# EAGLE schematic SenseBox-Eye_v1.2 (EAGLE 9.6.2)
Assembly variants: komplett, ohne fuel-gauge

## Sheet 1 of 5
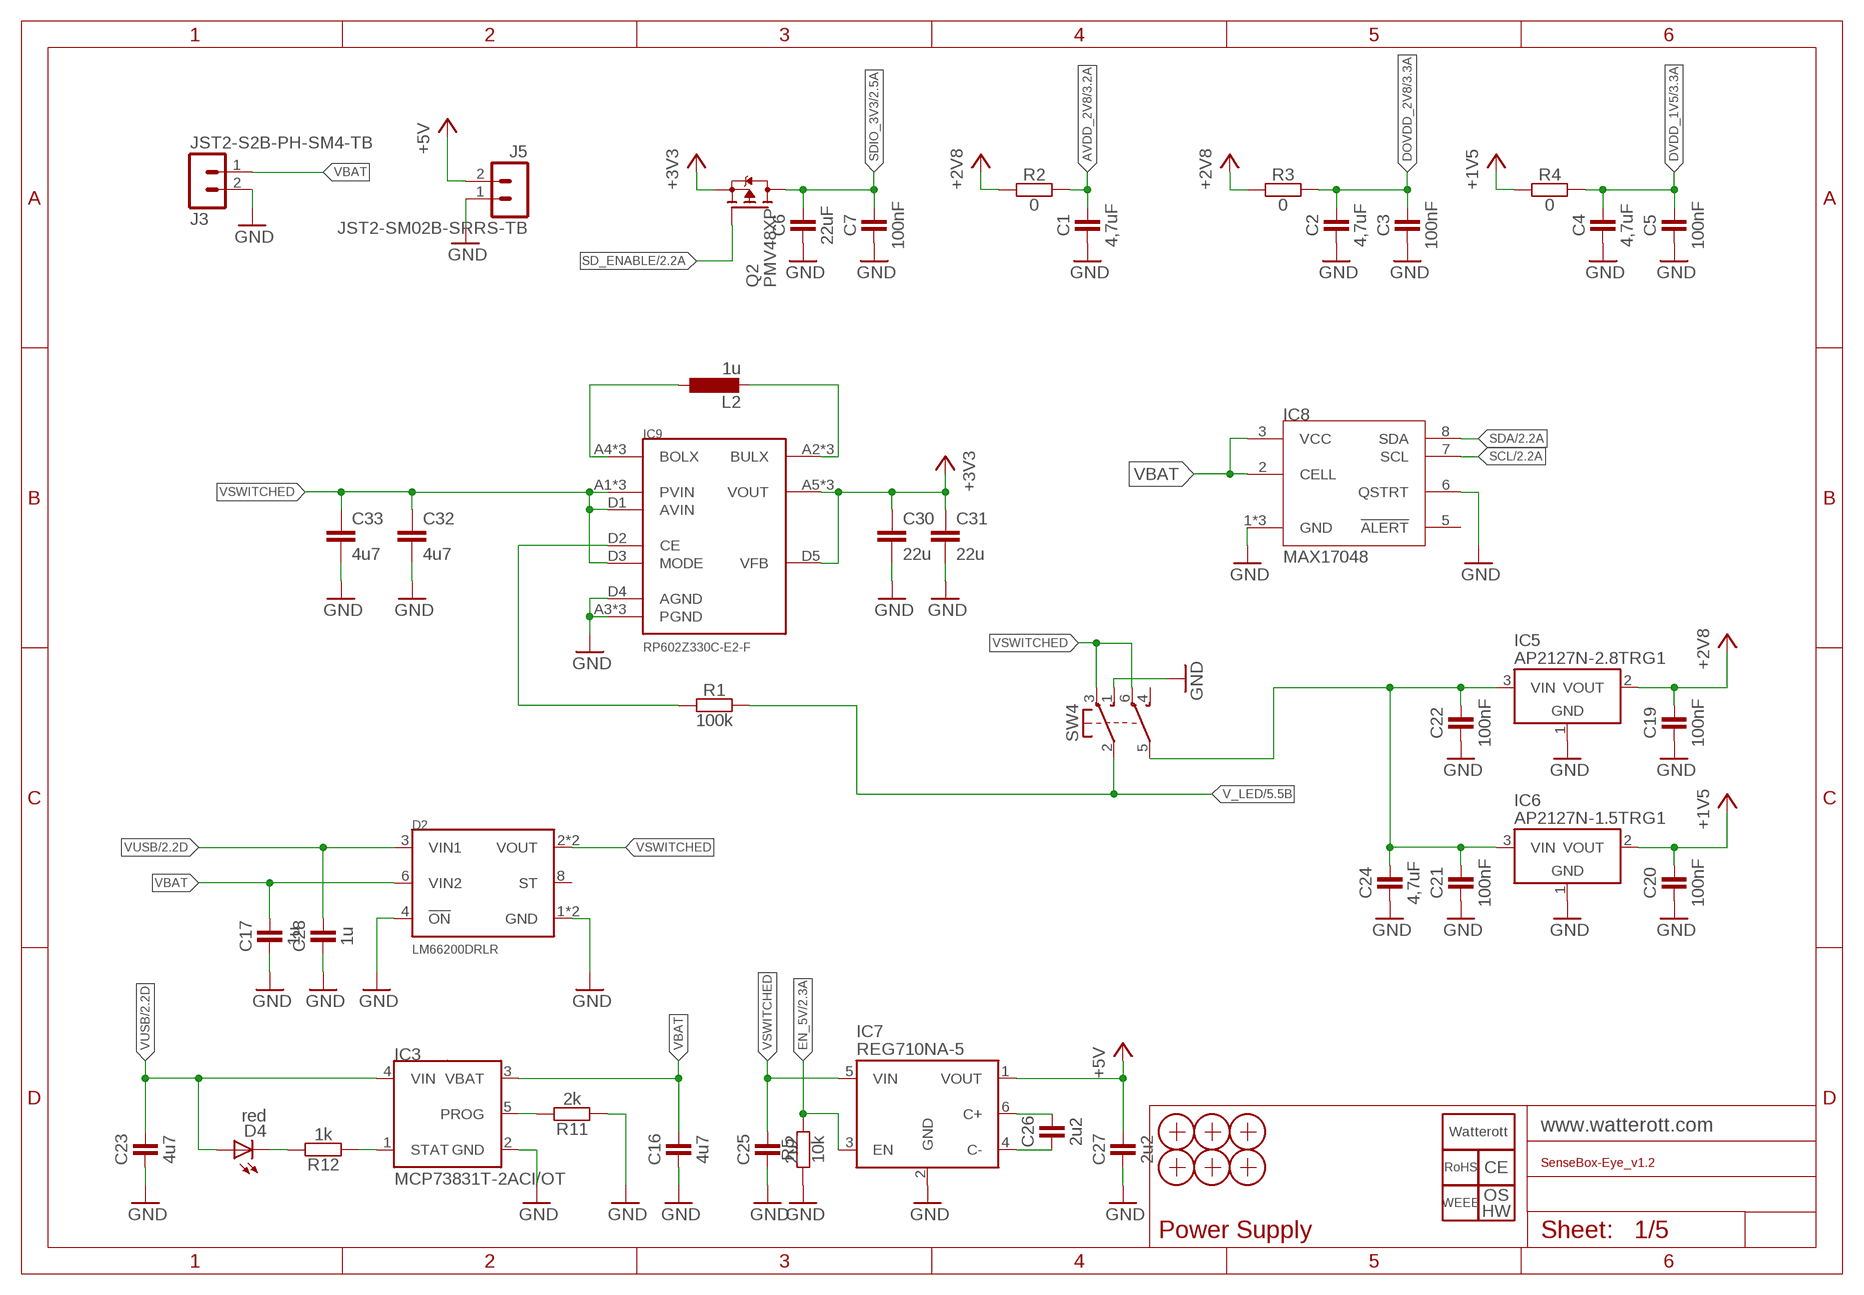
[diagram p0: schematic, sheet 1]

### Parts
C1  4,7uF  CAPACITOR-0402  [C0402]
C2  4,7uF  CAPACITOR-0402  [C0402]
C3  100nF  CAPACITOR-0402  [C0402]
C4  4,7uF  CAPACITOR-0402  [C0402]
C5  100nF  CAPACITOR-0402  [C0402]
C6  22uF  CAPACITOR-0402  [C0402]
C7  100nF  CAPACITOR-0402  [C0402]
C16  4u7  CAPACITOR-0402  [C0402]
C17  1u  CAPACITOR-0402  [C0402]
C19  100nF  CAPACITOR-0402  [C0402]
C20  100nF  CAPACITOR-0402  [C0402]
C21  100nF  CAPACITOR-0402  [C0402]
C22  100nF  CAPACITOR-0402  [C0402]
C23  4u7  CAPACITOR-0402  [C0402]
C24  4,7uF  CAPACITOR-0402  [C0402]
C25  2u2  CAPACITOR-0402  [C0402]
C26  2u2  CAPACITOR-0402  [C0402]
C27  2u2  CAPACITOR-0402  [C0402]
C28  1u  CAPACITOR-0402  [C0402]
C30  22u  C_22U_0805N  [0805N]
C31  22u  C_22U_0805N  [0805N]
C32  4u7  C_4U7_0603N  [0603N]
C33  4u7  C_4U7_0603N  [0603N]
D2  LM66200DRLR  LM66200  [SOT-5X3]
D4  red  LED_RED_0603N  [0603N]
IC3  MCP73831T-2ACI/OT  MCP73831_MCP73831T-2ACI/OT_SOT23-5  [SOT23-5]
IC5  AP2127N-2.8TRG1  VREG-TS9011-3V3  [SOT23]
IC6  AP2127N-1.5TRG1  VREG-TS9011-3V3  [SOT23]
IC7  REG710NA-5  [SOT23-6]
IC8  MAX17048  MAX1704X  [UDFN8_2020]  (not fitted in variant ohne fuel-gauge)
IC9  RP602Z330C-E2-F  RP602_RP602Z330C-E2-F_WLCSP-20-P1  [WLCSP-20-P1]
J3  JST2-S2B-PH-SM4-TB  [JST_S2B-PH-SM4-TB]
J5  JST2-SM02B-SRRS-TB  [JST_SM02B-SRSS-TB]
L2  1u  L_WE-LQS-1U_5040  [5040]
LOGO2  LOGO_CE-2  [CE_2MM]
LOGO3  LOGO_OSHW-2  [OSHW_2MM]
LOGO4  LOGO_ROHS-2  [ROHS_2MM]
LOGO5  LOGO_WEEE-4  [WEEE_4MM]
LOGO6  LOGO_SPARK-2  [SPARK_2MM]
Q2  PMV48XP  MOSFET-P_PMV48XP_SOT23'  [SOT23]
R1  100k  RESISTOR-0402  [C0402]
R2  0  RESISTOR-0402  [C0402]
R3  0  RESISTOR-0402  [C0402]
R4  0  RESISTOR-0402  [C0402]
R5  10k  RESISTOR-0402  [C0402]
R11  2k  RESISTOR-0402  [C0402]
R12  1k  RESISTOR-0402  [C0402]
SW4  SW-2UM-CUS22B  [CUS22B]
X1  PASSER-04  [PASSER_04MM]
X2  PASSER-04  [PASSER_04MM]
X3  PASSER-04  [PASSER_04MM]
X4  PASSER-04  [PASSER_04MM]
X5  PASSER-04  [PASSER_04MM]
X6  PASSER-04  [PASSER_04MM]

### Nets
+1V5: C20.2 IC6.2(VOUT) R4.1
+2V8: C19.2 IC5.2(VOUT) R2.1 R3.1
+3V3: C30.1 C31.1 IC9.A5(VOUT) IC9.B5(VOUT) IC9.C5(VOUT) IC9.D5(VFB) Q2.2(S) ; also sheet 2,4,5
+5V: C27.2 IC7.1(VOUT) J5.2
AVDD_2V8: C1.2 R2.2 ; also sheet 3
BOLX: IC9.A4(BOLX) IC9.B4(BOLX) IC9.C4(BOLX) L2.1
BULX: IC9.A2(BULX) IC9.B2(BULX) IC9.C2(BULX) L2.2
DOVDD_2V8: C2.2 C3.2 R3.2 ; also sheet 3
DVDD_1V5: C4.2 C5.2 R4.2 ; also sheet 3
EN_5V: IC7.3(EN) R5.2 ; also sheet 2
ENABLE_3V3: IC9.D2(CE) R1.1
GND: C1.1 C2.1 C3.1 C4.1 C5.1 C6.1 C7.1 C16.1 C17.1 C19.1 C20.1 C21.1 C22.1 C23.1 C24.1 C25.1 C27.1 C28.1 C30.2 C31.2 C32.2 C33.2 D2.1(GND) D2.4(!ON) D2.5(GND) IC3.2(GND) IC5.1(GND) IC6.1(GND) IC7.2(GND) IC8.1(GND) IC8.4(GND) IC8.6(QSTRT) IC8.TP(GND) IC9.A3(PGND) IC9.B3(PGND) IC9.C3(PGND) IC9.D4(AGND) J3.2 J5.1 R5.1 R11.1 SW4.1(NO1) ; also sheet 2,3,4,5
N$5: C26.2 IC7.6(C+)
N$6: C26.1 IC7.4(C-)
N$8: D4.C R12.2
N$9: IC3.1(STAT) R12.1
N$10: IC3.5(PROG) R11.2
SCL: IC8.7(SCL) ; also sheet 2,5
SD_ENABLE: Q2.1(G) ; also sheet 2
SDA: IC8.8(SDA) ; also sheet 2,5
SDIO_3V3: C6.2 C7.2 Q2.3(D) ; also sheet 2
V_LED: R1.2 SW4.2(C1) ; also sheet 5
VBAT: C16.2 C17.2 D2.6(VIN2) IC3.3(VBAT) IC8.2(CELL) IC8.3(VCC) J3.1
VIN: C21.2 C22.2 C24.2 IC5.3(VIN) IC6.3(VIN) SW4.5(C2)
VSWITCHED: C25.2 C32.1 C33.1 D2.2(VOUT) D2.7(VOUT) IC7.5(VIN) IC9.A1(PVIN) IC9.B1(PVIN) IC9.C1(PVIN) IC9.D1(AVIN) IC9.D3(MODE) SW4.3(NC1) SW4.6(NC2)
VUSB: C23.2 C28.2 D2.3(VIN1) D4.A IC3.4(VIN) ; also sheet 2
Unconnected: D2.8(ST) IC8.5(!ALERT) SW4.4(NO2)

### Notes on the sheet
- Power Supply

## Sheet 2 of 5
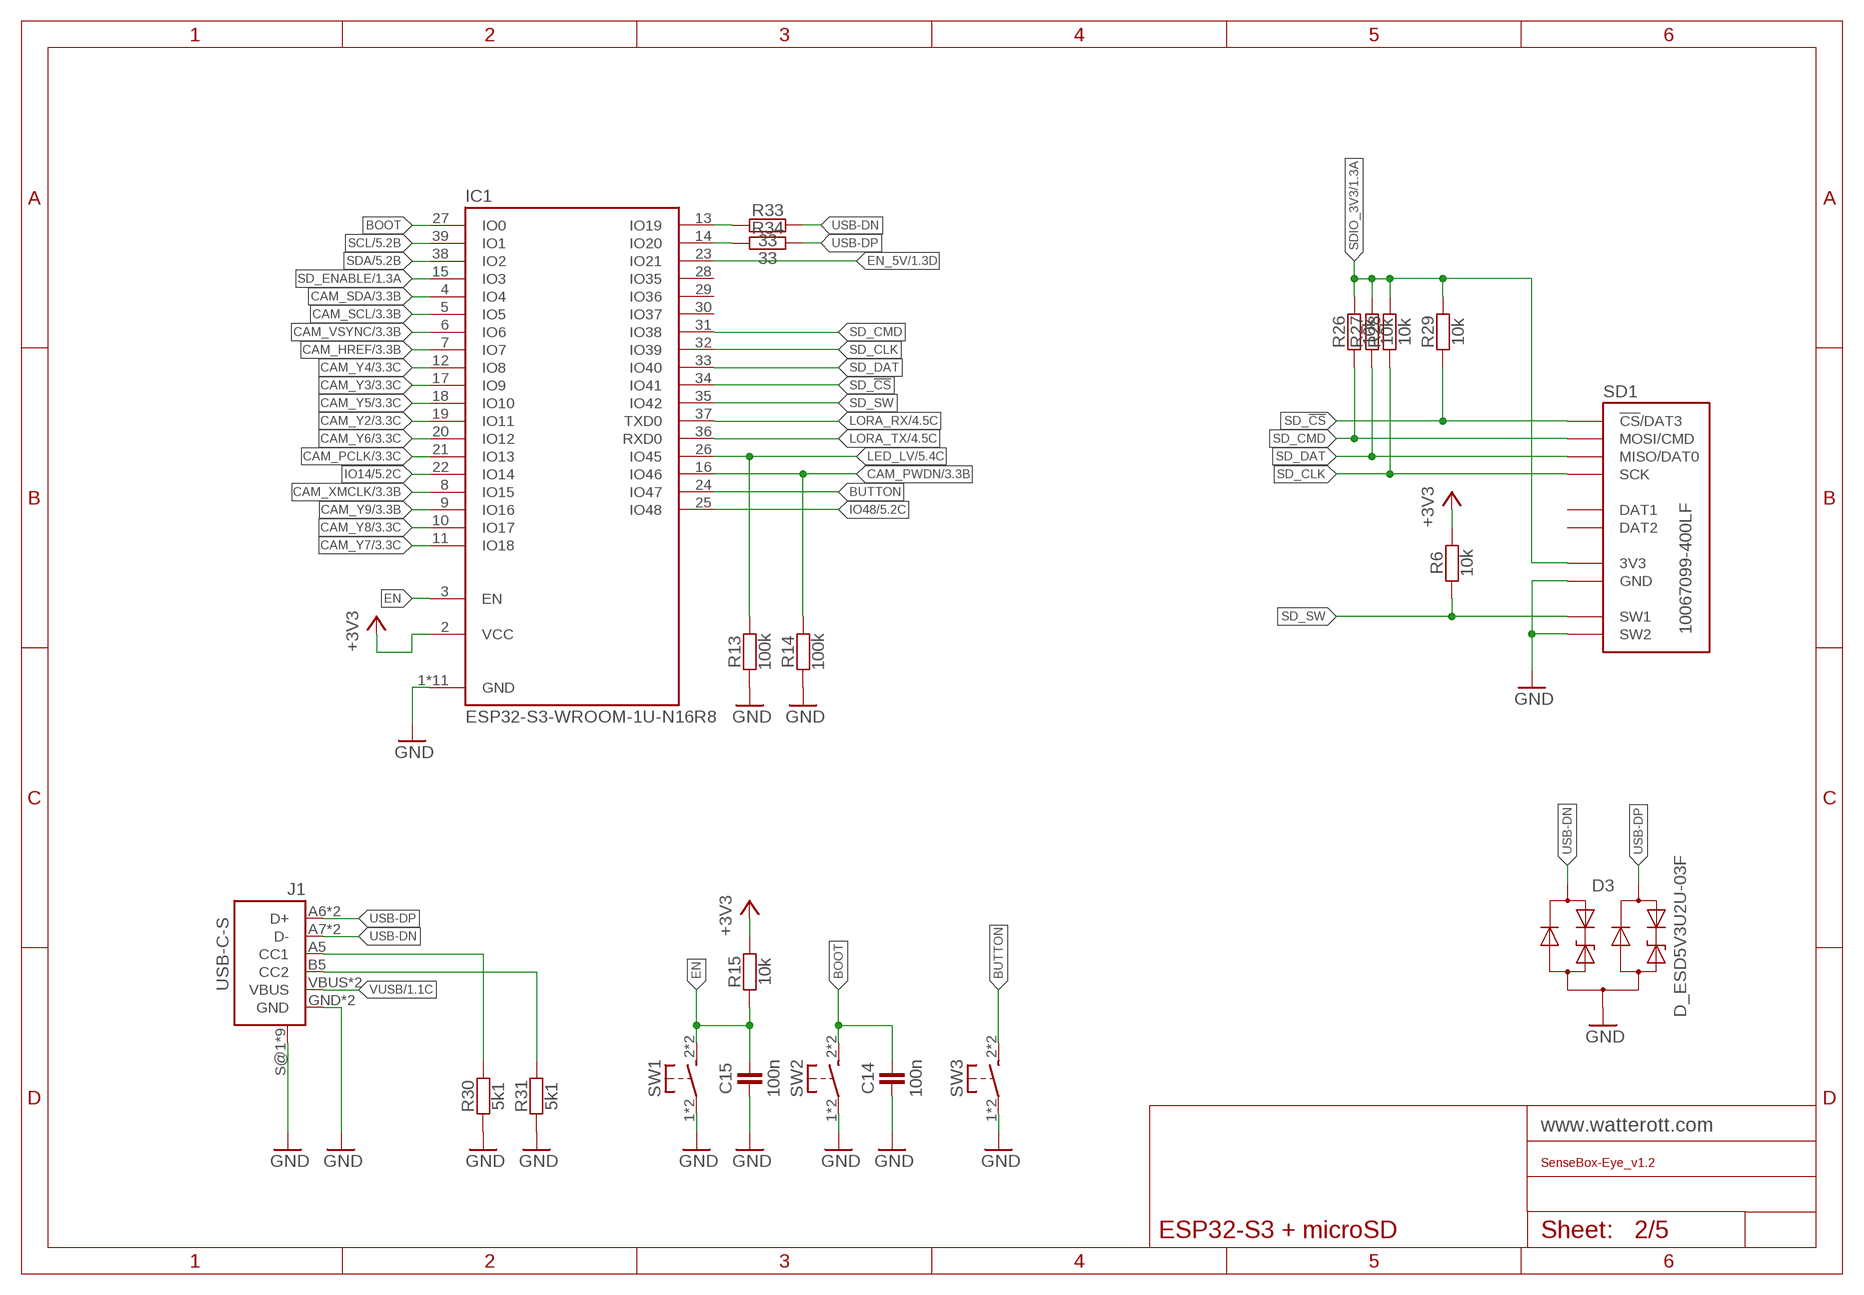
[diagram p1: schematic, sheet 2]

### Parts
C14  100n  CAPACITOR-0402  [C0402]
C15  100n  CAPACITOR-0402  [C0402]
D3  D_ESD5V3U2U-03F  [SOT723]
IC1  ESP32-S3-WROOM-1U-N16R8  ESP32_S3-WROOM-1  [ESP32-S3-WROOM-1U]
J1  USB-C-S  [USB-C-S]
R6  10k  RESISTOR-0402  [C0402]  (not fitted in variant ohne fuel-gauge)
R13  100k  RESISTOR-0402  [C0402]
R14  100k  RESISTOR-0402  [C0402]
R15  10k  RESISTOR-0402  [C0402]
R26  10k  RESISTOR-0402  [C0402]
R27  10k  RESISTOR-0402  [C0402]
R28  10k  RESISTOR-0402  [C0402]
R29  10k  RESISTOR-0402  [C0402]
R30  5k1  RESISTOR-0402  [C0402]
R31  5k1  RESISTOR-0402  [C0402]
R33  33  RESISTOR-0402  [C0402]
R34  33  RESISTOR-0402  [C0402]
SD1  10067099-400LF  SD-CARD-MSD47  [SD_47309XXXX]
SW1  SW-TACTILE-TL3305  [TL3305]
SW2  SW-TACTILE-TL3305  [TL3305]
SW3  SW-TACTILE-TL3305  [TL3305]

### Nets
+3V3: IC1.2(VCC) R6.2 R15.2 ; also sheet 1,4,5
BOOT: C14.2 IC1.27(IO0) SW2.2(S1) SW2.3(S1)
BUTTON: IC1.24(IO47) SW3.2(S1) SW3.3(S1)
CAM_HREF: IC1.7(IO7) ; also sheet 3
CAM_PCLK: IC1.21(IO13) ; also sheet 3
CAM_PWDN: IC1.16(IO46) R14.2 ; also sheet 3
CAM_SCL: IC1.5(IO5) ; also sheet 3
CAM_SDA: IC1.4(IO4) ; also sheet 3
CAM_VSYNC: IC1.6(IO6) ; also sheet 3
CAM_XMCLK: IC1.8(IO15) ; also sheet 3
CAM_Y2: IC1.19(IO11) ; also sheet 3
CAM_Y3: IC1.17(IO9) ; also sheet 3
CAM_Y4: IC1.12(IO8) ; also sheet 3
CAM_Y5: IC1.18(IO10) ; also sheet 3
CAM_Y6: IC1.20(IO12) ; also sheet 3
CAM_Y7: IC1.11(IO18) ; also sheet 3
CAM_Y8: IC1.10(IO17) ; also sheet 3
CAM_Y9: IC1.9(IO16) ; also sheet 3
CC1: J1.A5(CC1) R30.2
CC2: J1.B5(CC2) R31.2
EN: C15.2 IC1.3(EN) R15.1 SW1.2(S1) SW1.3(S1)
EN_5V: IC1.23(IO21) ; also sheet 1
GND: C14.1 C15.1 D3.3(A) IC1.1(GND) IC1.40(GND) IC1.P$1(GND) IC1.P$2(GND) IC1.P$3(GND) IC1.P$4(GND) IC1.P$5(GND) IC1.P$6(GND) IC1.P$7(GND) IC1.P$8(GND) IC1.P$9(GND) J1.GND J1.GND2(GND) J1.S@1(SHIELD) J1.S@2(SHIELD) J1.S@3(SHIELD) J1.S@4(SHIELD) J1.S@5(SHIELD) J1.S@6(SHIELD) J1.S@7(SHIELD) J1.S@8(SHIELD) J1.S@9(SHIELD) R13.1 R14.1 R30.1 R31.1 SD1.GND SD1.GND@1(GND) SD1.GND@2(GND) SD1.SW2 SW1.1 SW1.4(P1) SW2.1 SW2.4(P1) SW3.1 SW3.4(P1) ; also sheet 1,3,4,5
IO14: IC1.22(IO14) ; also sheet 5
IO19: IC1.13(IO19) R33.1
IO20: IC1.14(IO20) R34.1
IO48: IC1.25(IO48) ; also sheet 5
LED_LV: IC1.26(IO45) R13.2 ; also sheet 5
LORA_RX: IC1.37(TXD0) ; also sheet 4
LORA_TX: IC1.36(RXD0) ; also sheet 4
SCL: IC1.39(IO1) ; also sheet 1,5
SD_!CS: IC1.34(IO41) R29.1 SD1.CS(!CS!/DAT3)
SD_CLK: IC1.32(IO39) R28.1 SD1.SCK
SD_CMD: IC1.31(IO38) R26.1 SD1.MOSI(MOSI/CMD)
SD_DAT: IC1.33(IO40) R27.1 SD1.MISO(MISO/DAT0)
SD_ENABLE: IC1.15(IO3) ; also sheet 1
SD_SW: IC1.35(IO42) R6.1 SD1.SW1
SDA: IC1.38(IO2) ; also sheet 1,5
SDIO_3V3: R26.2 R27.2 R28.2 R29.2 SD1.VCC(3V3) ; also sheet 1
USB-DN: D3.1(C1) J1.A7(D-) J1.B7(D-) R33.2
USB-DP: D3.2(C2) J1.A6(D+) J1.B6(D+) R34.2
VUSB: J1.VBUS J1.VBUS2(VBUS) ; also sheet 1
Unconnected: IC1.28(IO35) IC1.29(IO36) IC1.30(IO37) SD1.DAT1 SD1.DAT2

### Notes on the sheet
- ESP32-S3 + microSD

## Sheet 3 of 5
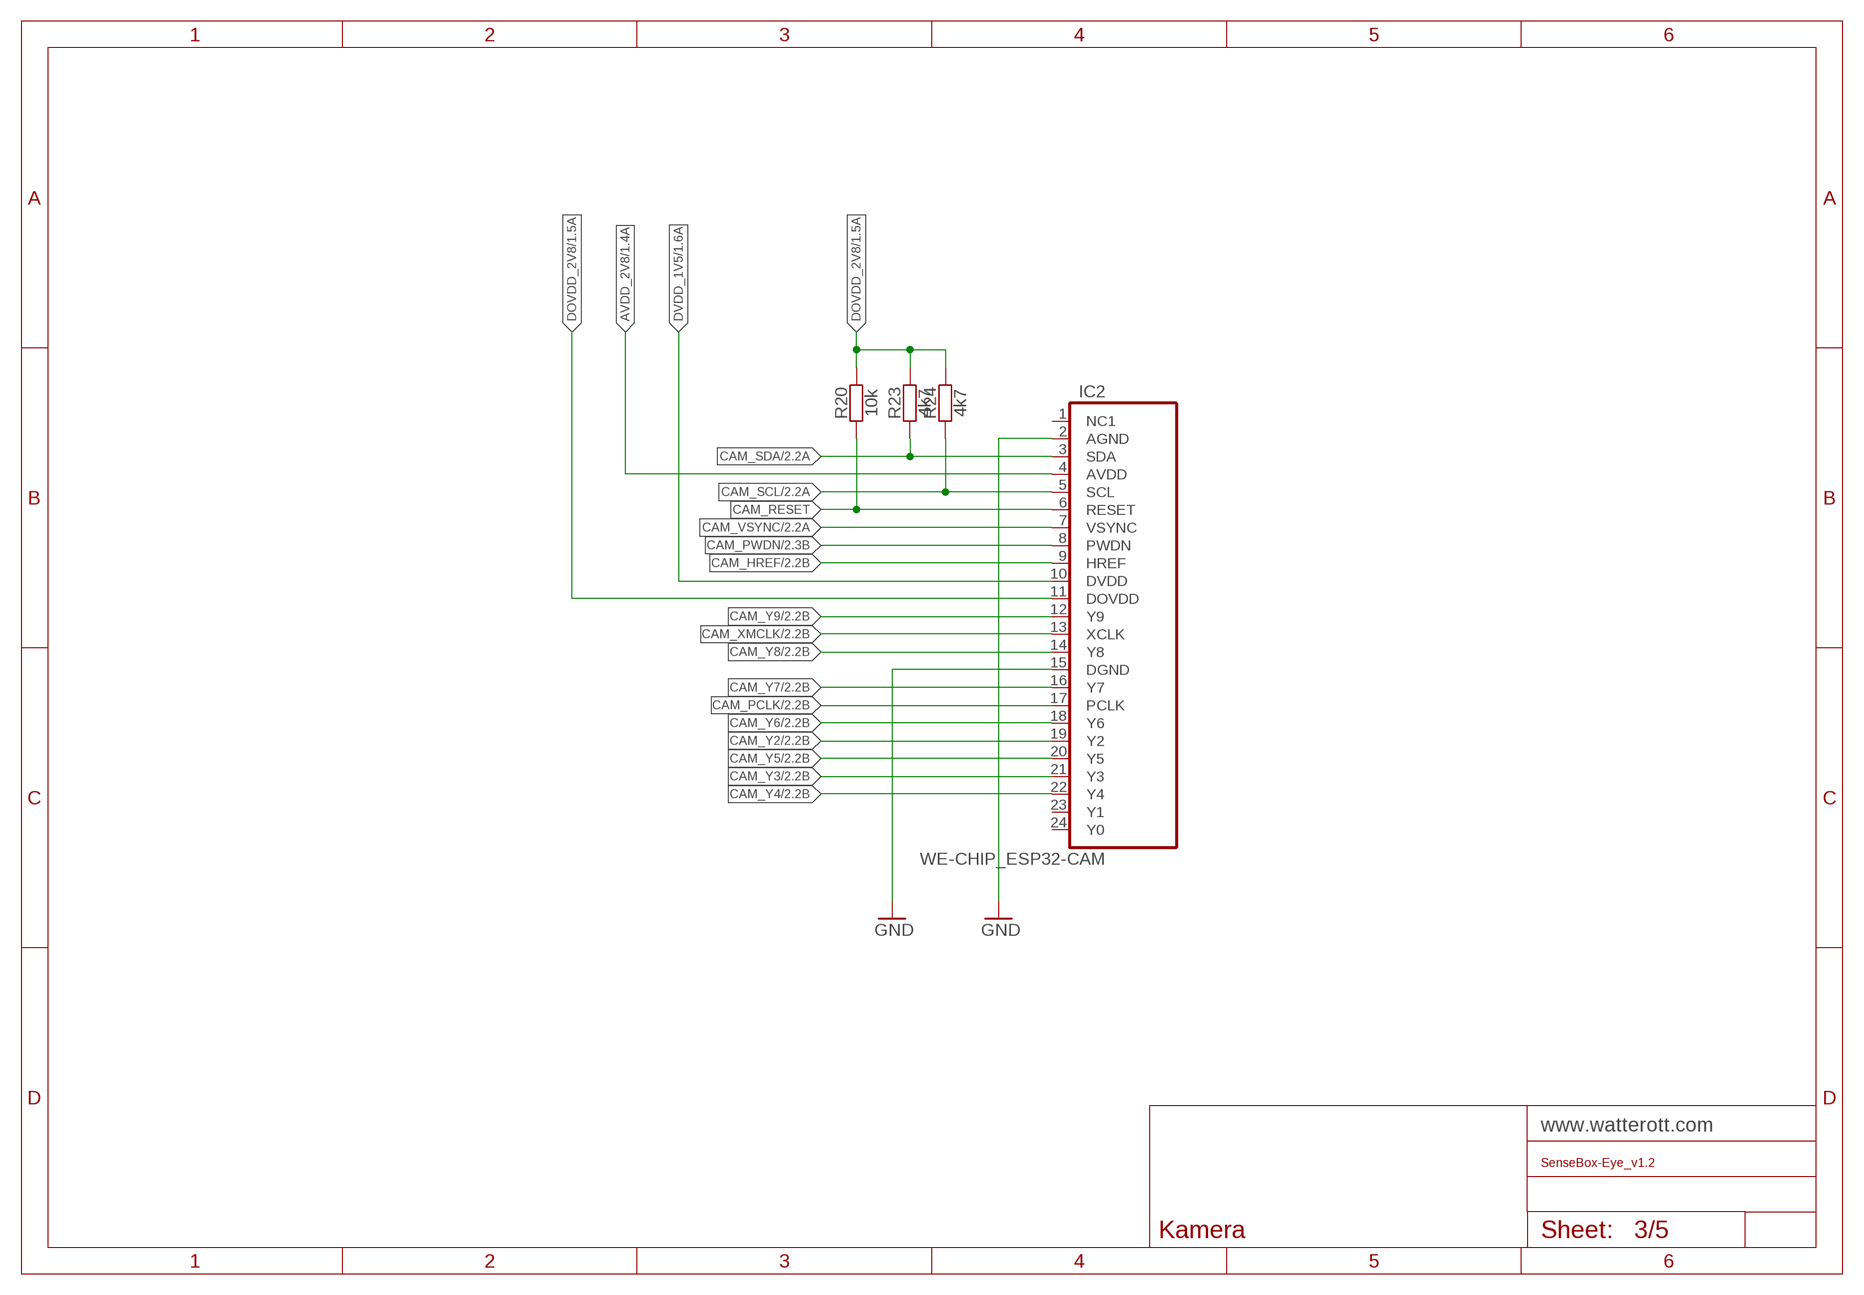
[diagram p2: schematic, sheet 3]

### Parts
IC2  WE-CHIP_ESP32-CAM  [WE-CHIP_FPC24-0.5-CAM]
R20  10k  RESISTOR-0402  [C0402]
R23  4k7  RESISTOR-0402  [C0402]
R24  4k7  RESISTOR-0402  [C0402]

### Nets
AVDD_2V8: IC2.4(AVDD) ; also sheet 1
CAM_HREF: IC2.9(HREF) ; also sheet 2
CAM_PCLK: IC2.17(PCLK) ; also sheet 2
CAM_PWDN: IC2.8(PWDN) ; also sheet 2
CAM_RESET: IC2.6(RESET) R20.1
CAM_SCL: IC2.5(SCL) R24.1 ; also sheet 2
CAM_SDA: IC2.3(SDA) R23.1 ; also sheet 2
CAM_VSYNC: IC2.7(VSYNC) ; also sheet 2
CAM_XMCLK: IC2.13(XCLK) ; also sheet 2
CAM_Y2: IC2.19(Y2) ; also sheet 2
CAM_Y3: IC2.21(Y3) ; also sheet 2
CAM_Y4: IC2.22(Y4) ; also sheet 2
CAM_Y5: IC2.20(Y5) ; also sheet 2
CAM_Y6: IC2.18(Y6) ; also sheet 2
CAM_Y7: IC2.16(Y7) ; also sheet 2
CAM_Y8: IC2.14(Y8) ; also sheet 2
CAM_Y9: IC2.12(Y9) ; also sheet 2
DOVDD_2V8: IC2.11(DOVDD) R20.2 R23.2 R24.2 ; also sheet 1
DVDD_1V5: IC2.10(DVDD) ; also sheet 1
GND: IC2.2(AGND) IC2.15(DGND) ; also sheet 1,2,4,5
Unconnected: IC2.1(NC1) IC2.23(Y1) IC2.24(Y0)

### Notes on the sheet
- Kamera

## Sheet 4 of 5
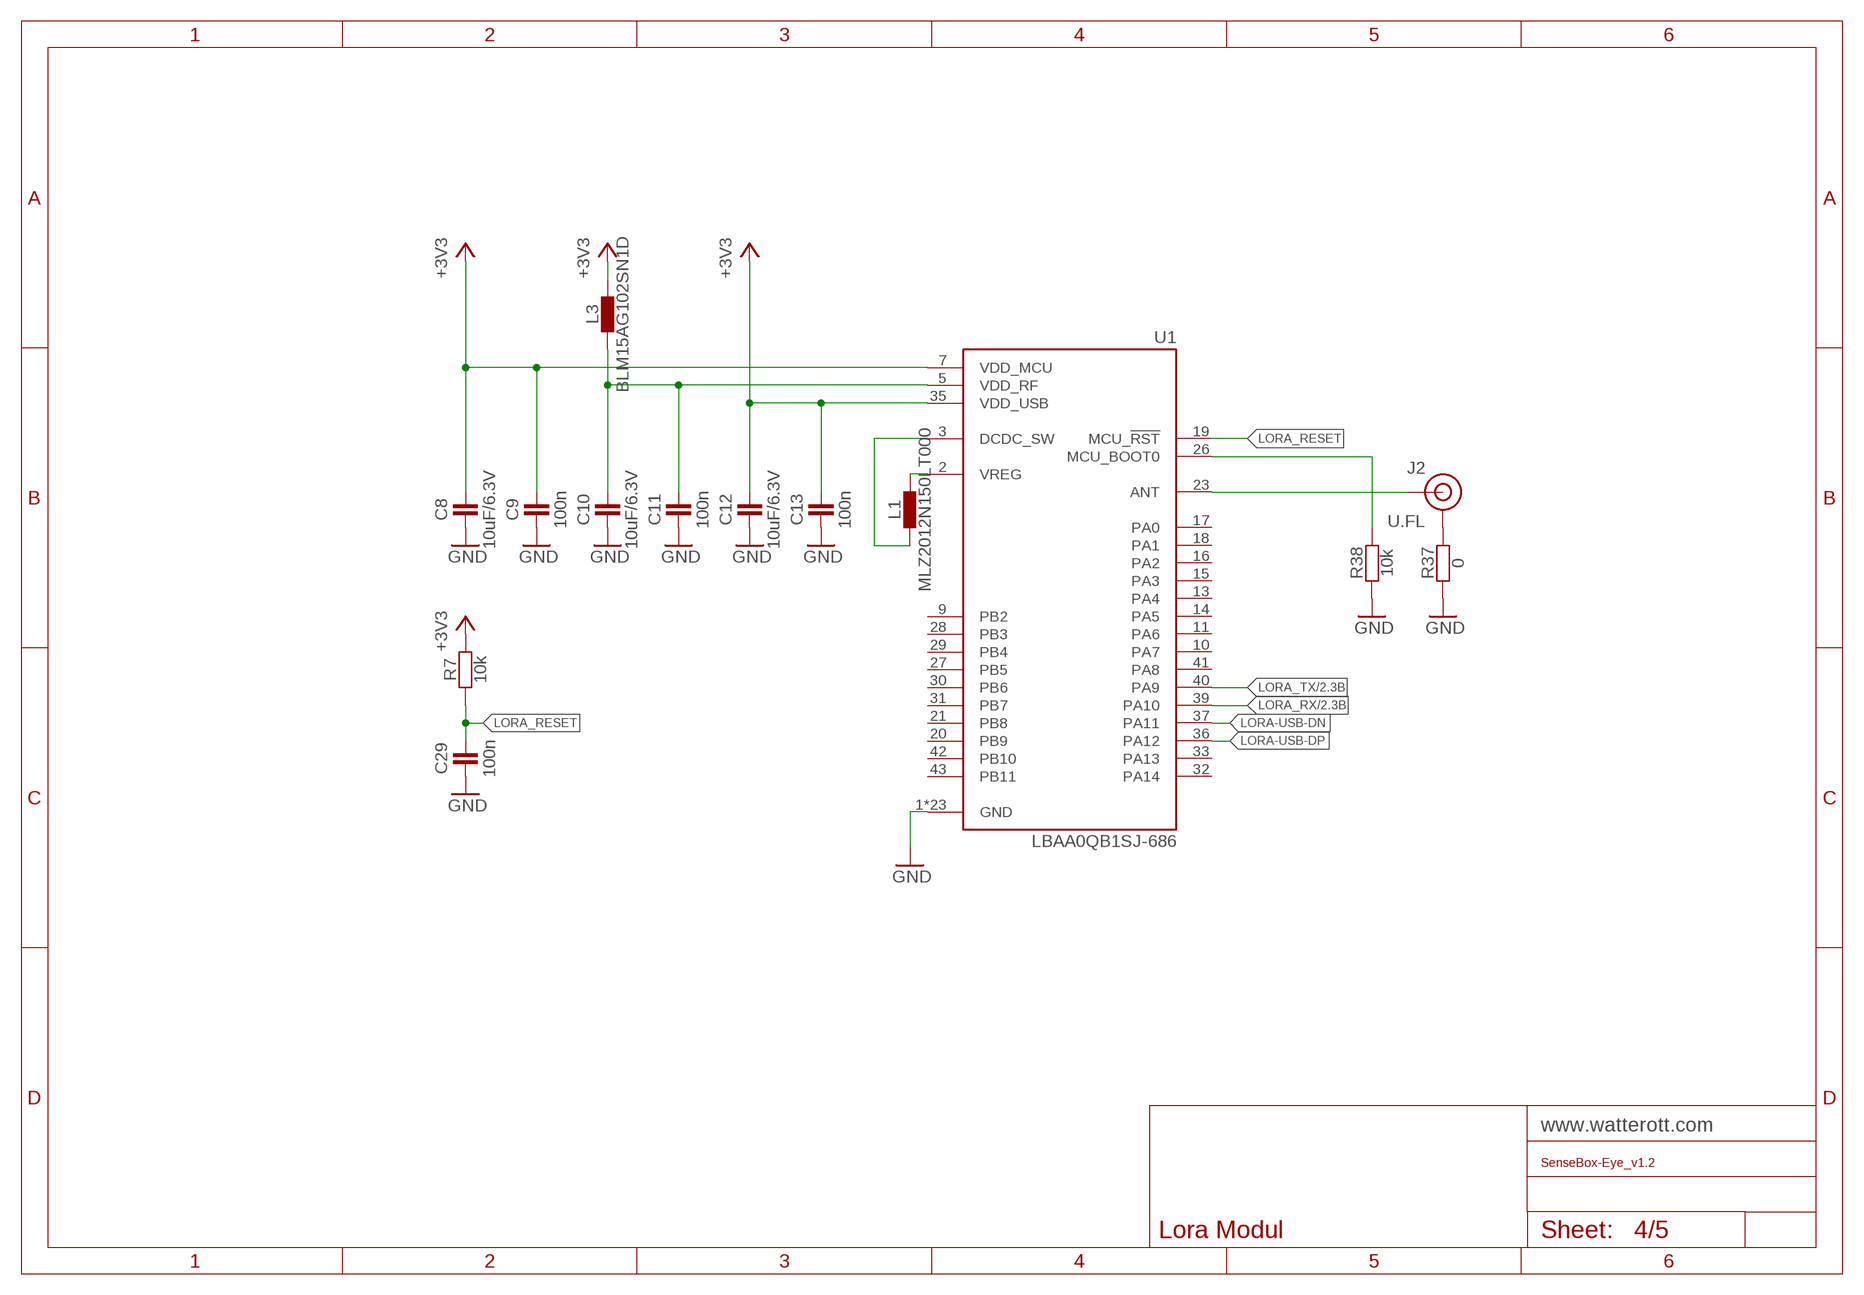
[diagram p3: schematic, sheet 4]

### Parts
C8  10uF/6.3V  CAPACITOR-0402  [C0402]
C9  100n  CAPACITOR-0402  [C0402]
C10  10uF/6.3V  CAPACITOR-0402  [C0402]
C11  100n  CAPACITOR-0402  [C0402]
C12  10uF/6.3V  CAPACITOR-0402  [C0402]
C13  100n  CAPACITOR-0402  [C0402]
C29  100n  CAPACITOR-0402  [C0402]
J2  U.FL  [U.FL]
L1  MLZ2012N150LT000  INDUCTOR-0805  [C0805]
L3  BLM15AG102SN1D  INDUCTOR-0402  [C0402]
R7  10k  RESISTOR-0402  [C0402]
R37  0  RESISTOR-0402  [C0402]
R38  10k  RESISTOR-0402  [C0402]
U1  LBAA0QB1SJ-686  LBAA0QB1SJ-296  [MODULE_LBAA0QB1SJ-296]

### Nets
+3V3: C8.2 C9.2 C12.2 C13.2 L3.2 R7.2 U1.7(VDD_MCU) U1.35(VDD_USB) ; also sheet 1,2,5
ANT: J2.FEED(SIGNAL) U1.23(ANT)
GND: C8.1 C9.1 C10.1 C11.1 C12.1 C13.1 C29.1 R37.1 R38.1 U1.1(GND) U1.4(GND) U1.6(GND) U1.8(GND) U1.12(GND) U1.22(GND) U1.24(GND) U1.25(GND) U1.34(GND) U1.38(GND) U1.44(GND) U1.45(GND) U1.46(GND) U1.47(GND) U1.48(GND) U1.49(GND) U1.50(GND) U1.51(GND) U1.52(GND) U1.53(GND) U1.54(GND) U1.55(GND) U1.56(GND) ; also sheet 1,2,3,5
LORA-USB-DN: U1.37(PA11)
LORA-USB-DP: U1.36(PA12)
LORA_RESET: C29.2 R7.1 U1.19(MCU_!RST)
LORA_RX: U1.39(PA10) ; also sheet 2
LORA_TX: U1.40(PA9) ; also sheet 2
MCU-BOOT0: R38.2 U1.26(MCU_BOOT0)
N$1: L1.2 U1.3(DCDC_SW)
N$2: L1.1 U1.2(VREG)
N$3: J2.1(GND) J2.2(GND) R37.2
VDD_RF: C10.2 C11.2 L3.1 U1.5(VDD_RF)
Unconnected: U1.9(PB2) U1.10(PA7) U1.11(PA6) U1.13(PA4) U1.14(PA5) U1.15(PA3) U1.16(PA2) U1.17(PA0) U1.18(PA1) U1.20(PB9) U1.21(PB8) U1.27(PB5) U1.28(PB3) U1.29(PB4) U1.30(PB6) U1.31(PB7) U1.32(PA14) U1.33(PA13) U1.41(PA8) U1.42(PB10) U1.43(PB11)

### Notes on the sheet
- Lora Modul

## Sheet 5 of 5
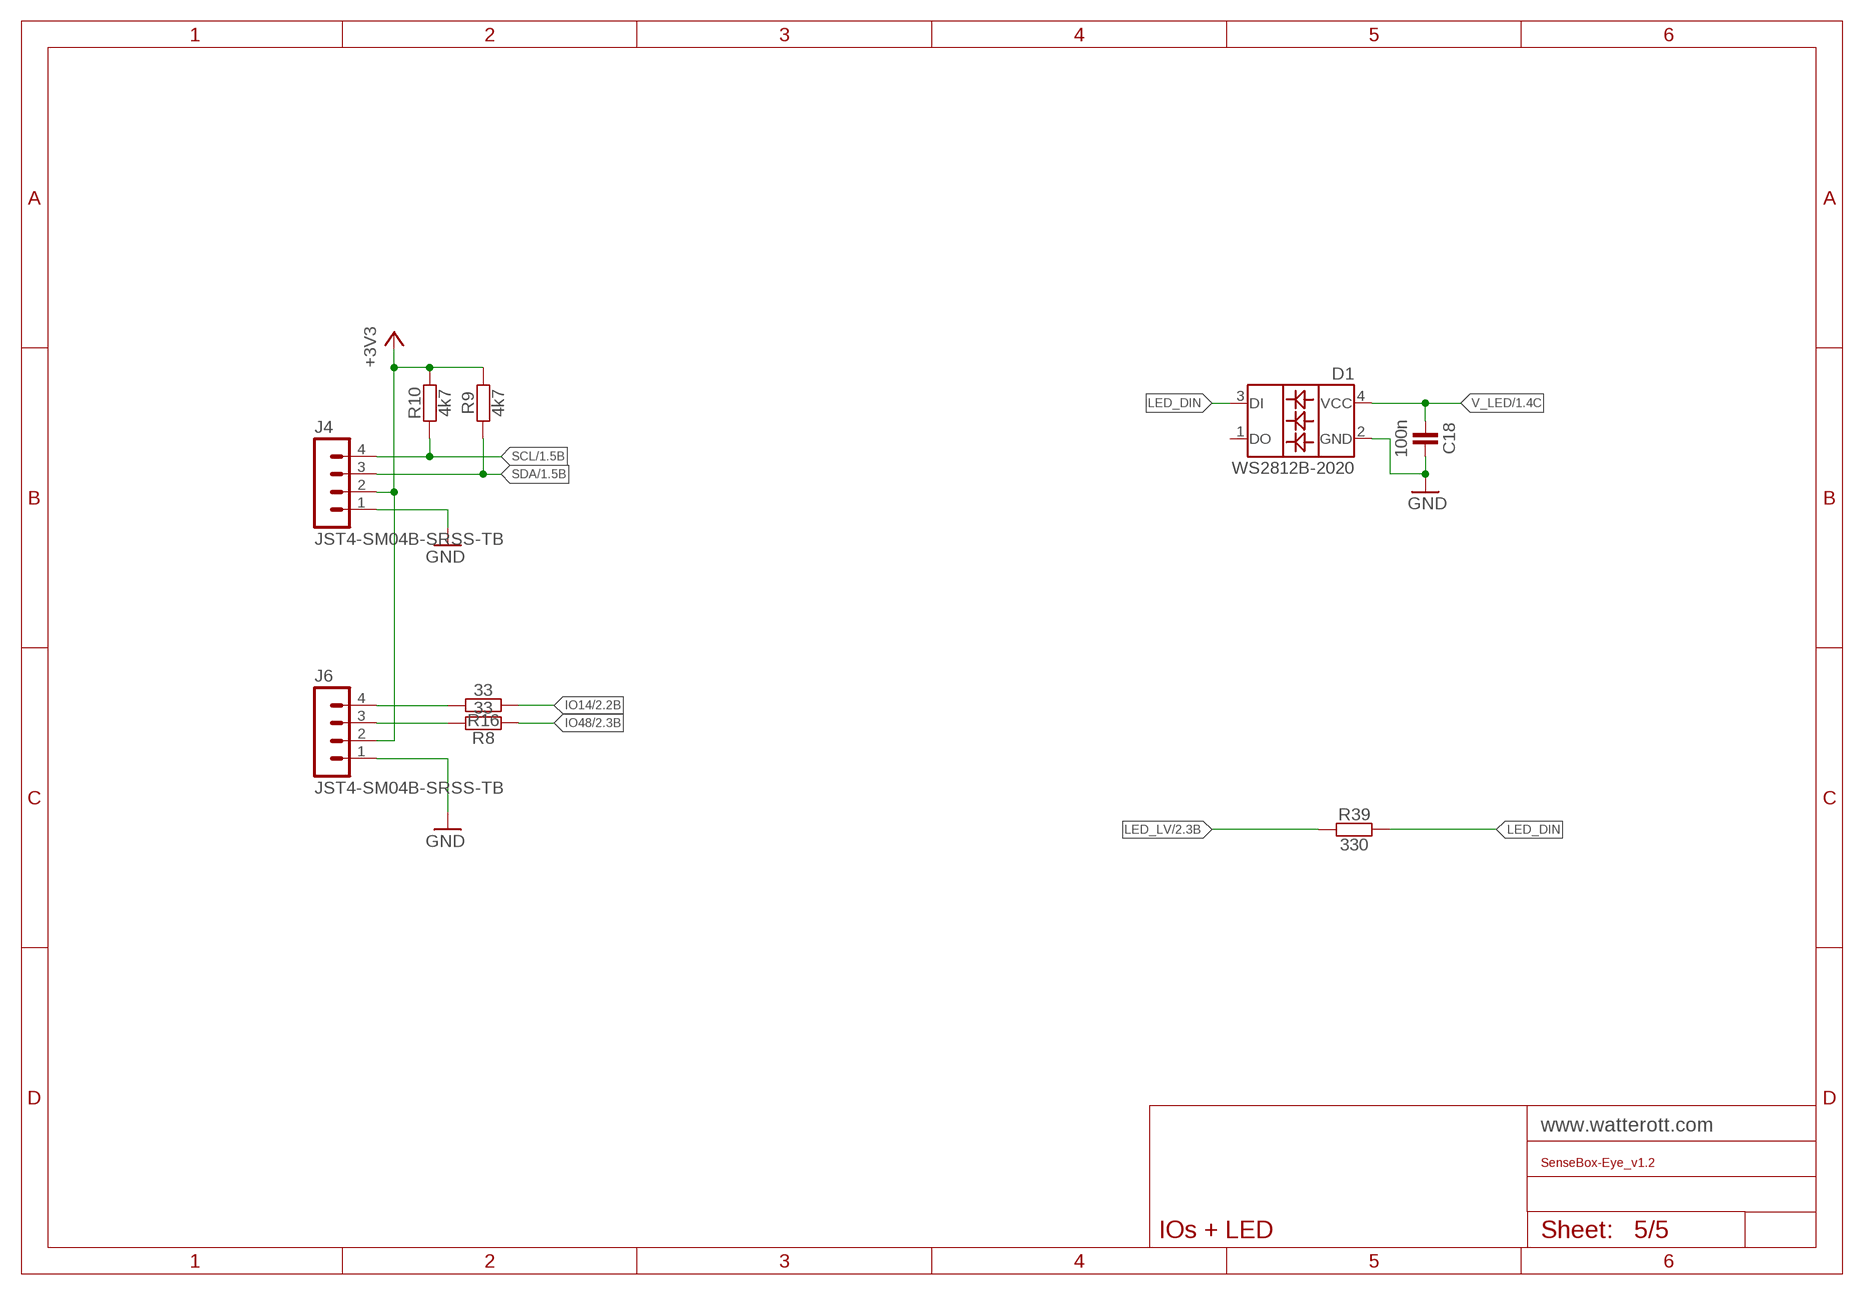
[diagram p4: schematic, sheet 5]

### Parts
C18  100n  CAPACITOR-0402  [C0402]
D1  WS2812B-2020  [WS2812_2020]
J4  JST4-SM04B-SRSS-TB  [JST_SM04B-SRSS-TB]
J6  JST4-SM04B-SRSS-TB  [JST_SM04B-SRSS-TB]
R8  33  RESISTOR-0402  [C0402]
R9  4k7  RESISTOR-0402  [C0402]
R10  4k7  RESISTOR-0402  [C0402]
R16  33  RESISTOR-0402  [C0402]
R39  330  RESISTOR-0402  [C0402]

### Nets
+3V3: J4.2 J6.2 R9.1 R10.1 ; also sheet 1,2,4
GND: C18.1 D1.2(GND) J4.1 J6.1 ; also sheet 1,2,3,4
IO14: R16.2 ; also sheet 2
IO48: R8.2 ; also sheet 2
LED_DIN: D1.3(DI) R39.2
LED_LV: R39.1 ; also sheet 2
N$4: J6.4 R16.1
N$13: J6.3 R8.1
SCL: J4.4 R10.2 ; also sheet 1,2
SDA: J4.3 R9.2 ; also sheet 1,2
V_LED: C18.2 D1.4(VCC) ; also sheet 1
Unconnected: D1.1(DO)

### Notes on the sheet
- IOs + LED

## Library data of the parts
C1-C29 = we-rcl:CAPACITOR: Capacitor ...2.2uF @ 6.3V -> 0402 ...4.7uF @ 6.3V -> 0603 ...10uF @ 16V -> 0805 ...22uF @ 25V -> 1206
C30 C31 = BE_capacitor:C: Capacitor; BE#: 208; DIELECTRIC: X5R; VOLTAGE: 6V3
C32 C33 = BE_capacitor:C: Capacitor; BE#: 284; DIELECTRIC: X5R; VOLTAGE: 6V3
D1 = we-opto:WS2812B: WS2812 RGB LED (built-in driver)
D2 = BE_diode:LM66200: LM66200 1.6-5V, 2.5A Dual Ideal Diode with Automatic Switchover; BE#: 2291
D3 = we-rcl:D_ESD5V3U2U: ESD5V3U2U TVS Diode (Uni-directional Ultra Low ESD) Vrwm=5.3V, 0.4pF@1MHz; DIGIKEY: ESD5V3U2U-03F H6327DKR-ND
D4 = BE_opto:LED: Single LED; BE#: 224
IC1 = we-chip:ESP32_S3-WROOM-1: Espressif ESP32-S3-WROOM-1U ESP32 WiFi/WLAN + Bluetooth/BLE Module<
IC2 = SenseBox-Eye:WE-CHIP_ESP32-CAM: ESP32-CAM OV2640 Camera module
IC3 = BE_dcdc:MCP73831: Miniature Single-Cell, Fully Integrated Li-Ion, Li-Polymer Charge Management Controllers up to 500mA; BE#: 2283
IC5 IC6 = we-power:VREG: Voltage Regulator LDOs Taiwan Semi TS1117 800mA max 15V - compatible On Semi NCP1117 1A max 20V - compatible Diodes AP2111H 0.6A max 6V (0.25V@0.6A) - compatible Diodes AP2114H 1A max 6V (0.45V@1A) Taiwan Semi TS9011 250mA max 12V - compatible Diodes AP2210 300mA max 15V - compatible Microchip MCP1700 250mA max 6.5V - compatible Microchip MCP1702 250mA max 13V - compatible Microchip MCP1703 250mA max 16V - compatible Microchip MCP1754 150mA max 16V Taiwan Semi TS5204 80mA max 16V (low noise) - compatible Diodes AP7313-xxSA 150mA max 6V - compatible Diodes AP7333-xxSA 300mA max 6V DC/DC Converter Modules Recom R-78Ex.x-1.0-W36 1A max 28V - compatible CUI V78xx-2000 2A max 18V Murata OKI-78SR-x.x/1.5-W36 1.5A max 36V
IC7 = we-power:REG710NA: TI REG710xx Charge Pump with Regulated Output TI REG710xx (60mA) 5.5V - REG71055 5.0V - REG710NA-5 or REG71050 3.3V - REG710NA-3.3 3.0V - REG710NA-3 2.7V - REG710NA-2.7 2.5V - REG710NA-2.5 Diodes AP3602 (100mA) 5.0V - AP3602A 4.5V - AP3602B OnSemi CAT3200 (100mA) 5.0V - CAT3200TDI
IC8 = we-power:MAX1704X
IC9 = BE_dcdc:RP602: 1.5 A PWM/VFM Buck-Boost DC/DC Converter with Synchronous Rectifier; BE#: 2281
J1 = we-con:USB-C: USB-C Connector Hroparts TYPE-C-31-M-12 or Jing C167321 or XKB U262-161N-4BVC11 Up: XKB U263-241N-4BQC11-1 or Wuerth 632722110112
J2 = we-con:U.FL: U.FL Connector
J3 J5 = we-con:JST2: JST Connector
J4 J6 = we-con:JST4: JST Connector
L1 L3 = we-rcl:INDUCTOR: Inductor Ferrite Bead - Murata BLM18PG 0603 3.0A 33Ohm @ 100MHz -> BLM18PG330SN1D 0603 2.0A 120Ohm @ 100MHz -> BLM18PG121SN1D 0603 1.4A 220Ohm @ 100MHz -> BLM18PG221SN1D 0603 1.2A 330Ohm @ 100MHz -> BLM18PG331SN1D 0603 1.0A 470Ohm @ 100MHz -> BLM18PG471SN1D L4040 BOURNS SRN4018 Serie
L2 = BE_inductor:L: Inductor; BE#: 2282; CURRENT: 4.9; INDUCTANCE: 1u
LOGO2 = we-symbol:LOGO_CE: CE Logo
LOGO3 = we-symbol:LOGO_OSHW: Open-Source-Hardware Logo
LOGO4 = we-symbol:LOGO_ROHS: RoHS Logo
LOGO5 = we-symbol:LOGO_WEEE: WEEE Logo
LOGO6 = we-symbol:LOGO_SPARK: Watterott electronic Logo
Q2 = BE_transistor:MOSFET-P: Single P-Channel Mosfet; BE#: 271; CURRENT: 3.5; VOLTAGE: 20
R1-R16 R20 R23 R24 R26-R31 R33 R34 R37-R39 = we-rcl:RESISTOR: Resistor all kinds in 0402 and 0603
SD1 = we-con:SD-CARD: SD-Card Socket
SW1-SW3 = we-switch:SW-TACTILE: Tactile Switche
SW4 = we-switch:SW-2UM: Switch; DIGIKEY: 563-1105-6-ND
U1 = LBAA0QB1SJ-296:LBAA0QB1SJ-296; MANUFACTURER: Murata; MAXIMUM_PACKAGE_HEIGHT: 1.6 mm; PARTREV: F; STANDARD: Manufacturer Recommendations
X1-X6 = we-symbol:PASSER: Fiducial Marker